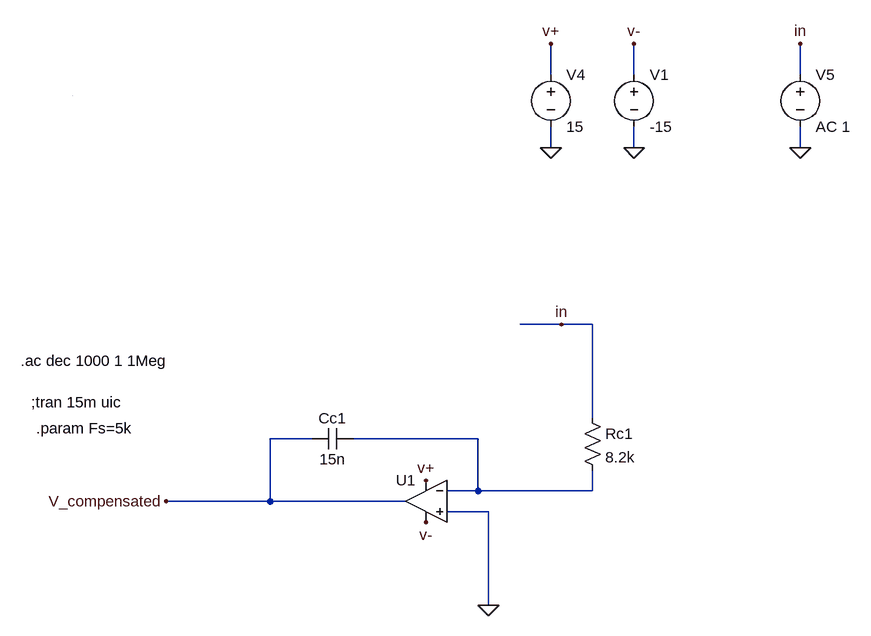
[diagram p0: schematic Compensator1_AC.asc]
Compensator1_AC.asc, the LTspice schematic file:
Version 4
SHEET 1 1764 1252
WIRE 736 -32 736 -80
WIRE 864 -32 864 -80
WIRE 1120 -32 1120 -80
WIRE 736 80 736 48
WIRE 864 80 864 48
WIRE 1120 80 1120 48
WIRE 752 352 688 352
WIRE 800 352 752 352
WIRE 800 496 800 352
WIRE 368 528 304 528
WIRE 624 528 432 528
WIRE 624 608 624 528
WIRE 624 608 576 608
WIRE 800 608 800 576
WIRE 800 608 624 608
WIRE 304 624 304 528
WIRE 304 624 144 624
WIRE 512 624 304 624
WIRE 640 640 576 640
WIRE 640 784 640 640
WIRE 0 0 0 0
FLAG 640 784 0
FLAG 544 592 v+
FLAG 736 80 0
FLAG 864 80 0
FLAG 736 -80 v+
FLAG 864 -80 v-
FLAG 544 656 v-
FLAG 1120 80 0
FLAG 1120 -80 in
FLAG 752 352 in
FLAG 144 624 V_compensated
SYMBOL res 784 480 R0
SYMATTR InstName Rc1
SYMATTR Value 8.2k
SYMBOL cap 432 512 R90
WINDOW 0 0 32 VBottom 2
WINDOW 3 32 32 VTop 2
SYMATTR InstName Cc1
SYMATTR Value 15n
SYMBOL voltage 864 -48 R0
WINDOW 123 0 0 Left 0
WINDOW 39 0 0 Left 0
SYMATTR InstName V1
SYMATTR Value -15
SYMBOL voltage 736 -48 R0
WINDOW 123 0 0 Left 0
WINDOW 39 0 0 Left 0
SYMATTR InstName V4
SYMATTR Value 15
SYMBOL OpAmps\\UniversalOpAmp2 544 624 M0
SYMATTR InstName U1
SYMBOL voltage 1120 -48 R0
WINDOW 123 0 0 Left 0
WINDOW 39 0 0 Left 0
SYMATTR InstName V5
SYMATTR Value AC 1
TEXT -64 472 Left 2 !;tran 15m uic
TEXT -56 512 Left 2 !.param Fs=5k
TEXT -80 408 Left 2 !.ac dec 1000 1 1Meg

The netlist it stands for:
* Compensator1_AC.asc
Rc1 in N001 8.2k
Cc1 N001 V_compensated 15n
V1 v- 0 -15
V4 v+ 0 15
XU1 0 N001 v+ v- V_compensated level2 Avol=1Meg GBW=10Meg Slew=10Meg Ilimit=25m Rail=0 Vos=0 En=0 Enk=0 In=0 Ink=0 Rin=500Meg  ; pins In+ In- V+ V- OUT
V5 in 0 AC 1
;tran 15m uic
.param Fs=5k
.ac dec 1000 1 1Meg
.lib UniversalOpAmp2.lib
.backanno
.end